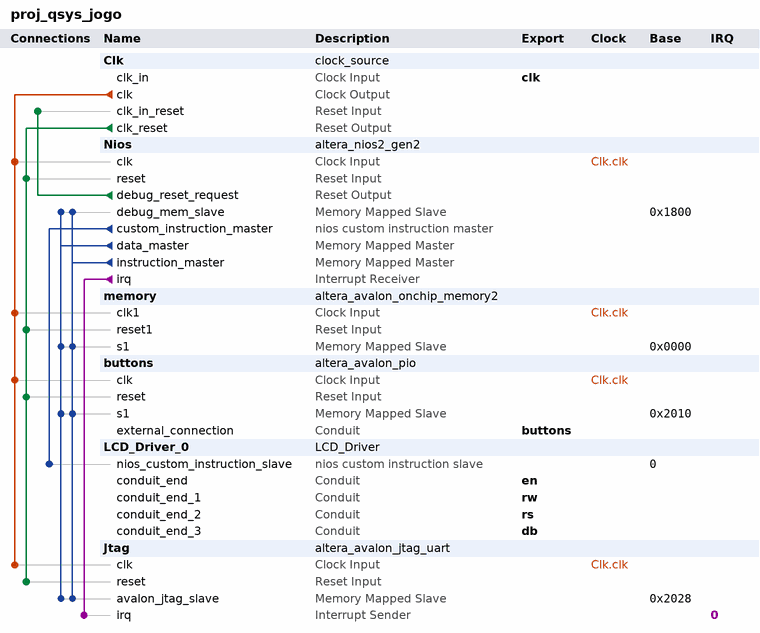
[diagram p0: system contents]
# Platform Designer (Qsys) system proj_qsys_jogo, Cyclone IV E EP4CE6E22C8
# Parameters at their usual value, and those the tool derives, are not listed.
package require -exact qsys 18.0
create_system proj_qsys_jogo
set_project_property DEVICE_FAMILY {Cyclone IV E}
set_project_property DEVICE EP4CE6E22C8

add_instance Clk clock_source 18.0
set_instance_parameter_value Clk clockFrequency 50000000

add_instance Nios altera_nios2_gen2 18.0
set_instance_parameter_value Nios dcache_size 2048
set_instance_parameter_value Nios exceptionSlave memory.s1
set_instance_parameter_value Nios icache_size 4096
set_instance_parameter_value Nios impl Tiny
set_instance_parameter_value Nios resetSlave memory.s1

add_instance memory altera_avalon_onchip_memory2 18.0
set_instance_parameter_value memory dataWidth 32
set_instance_parameter_value memory dualPort false
set_instance_parameter_value memory initMemContent true
set_instance_parameter_value memory initializationFileName onchip_mem.hex
set_instance_parameter_value memory memorySize 4096
set_instance_parameter_value memory useNonDefaultInitFile true

add_instance buttons altera_avalon_pio 18.0
set_instance_parameter_value buttons direction Input
set_instance_parameter_value buttons width 4

add_instance LCD_Driver_0 LCD_Driver 1.0

add_instance Jtag altera_avalon_jtag_uart 18.0
set_instance_parameter_value Jtag simInteractiveOptions NO_INTERACTIVE_WINDOWS

# connections
add_connection Clk.clk buttons.clk clock
add_connection Clk.clk Jtag.clk clock
add_connection Clk.clk memory.clk1 clock
add_connection Clk.clk Nios.clk clock
add_connection Clk.clk_reset buttons.reset reset
add_connection Clk.clk_reset Jtag.reset reset
add_connection Clk.clk_reset memory.reset1 reset
add_connection Clk.clk_reset Nios.reset reset
add_connection Nios.debug_reset_request Clk.clk_in_reset reset
add_connection Nios.data_master buttons.s1 avalon
set_connection_parameter_value Nios.data_master/buttons.s1 baseAddress 0x2010
add_connection Nios.data_master Jtag.avalon_jtag_slave avalon
set_connection_parameter_value Nios.data_master/Jtag.avalon_jtag_slave baseAddress 0x2028
add_connection Nios.data_master memory.s1 avalon
set_connection_parameter_value Nios.data_master/memory.s1 baseAddress 0x0000
add_connection Nios.data_master Nios.debug_mem_slave avalon
set_connection_parameter_value Nios.data_master/Nios.debug_mem_slave baseAddress 0x1800
add_connection Nios.instruction_master buttons.s1 avalon
set_connection_parameter_value Nios.instruction_master/buttons.s1 baseAddress 0x2010
add_connection Nios.instruction_master Jtag.avalon_jtag_slave avalon
set_connection_parameter_value Nios.instruction_master/Jtag.avalon_jtag_slave baseAddress 0x2028
add_connection Nios.instruction_master memory.s1 avalon
set_connection_parameter_value Nios.instruction_master/memory.s1 baseAddress 0x0000
add_connection Nios.instruction_master Nios.debug_mem_slave avalon
set_connection_parameter_value Nios.instruction_master/Nios.debug_mem_slave baseAddress 0x1800
add_connection Nios.irq Jtag.irq interrupt
set_connection_parameter_value Nios.irq/Jtag.irq irqNumber 0
add_connection Nios.custom_instruction_master LCD_Driver_0.nios_custom_instruction_slave nios_custom_instruction
set_connection_parameter_value Nios.custom_instruction_master/LCD_Driver_0.nios_custom_instruction_slave CIName lcd_driver_0
set_connection_parameter_value Nios.custom_instruction_master/LCD_Driver_0.nios_custom_instruction_slave baseAddress 0

# exported interfaces
add_interface buttons conduit end
set_interface_property buttons EXPORT_OF buttons.external_connection
add_interface clk clock sink
set_interface_property clk EXPORT_OF Clk.clk_in
add_interface db conduit end
set_interface_property db EXPORT_OF LCD_Driver_0.conduit_end_3
add_interface en conduit end
set_interface_property en EXPORT_OF LCD_Driver_0.conduit_end
add_interface rs conduit end
set_interface_property rs EXPORT_OF LCD_Driver_0.conduit_end_2
add_interface rw conduit end
set_interface_property rw EXPORT_OF LCD_Driver_0.conduit_end_1

set_interconnect_requirement {$system} qsys_mm.clockCrossingAdapter HANDSHAKE
set_interconnect_requirement {$system} qsys_mm.enableEccProtection FALSE
set_interconnect_requirement {$system} qsys_mm.insertDefaultSlave FALSE
set_interconnect_requirement {$system} qsys_mm.maxAdditionalLatency 1

save_system proj_qsys_jogo.qsys
